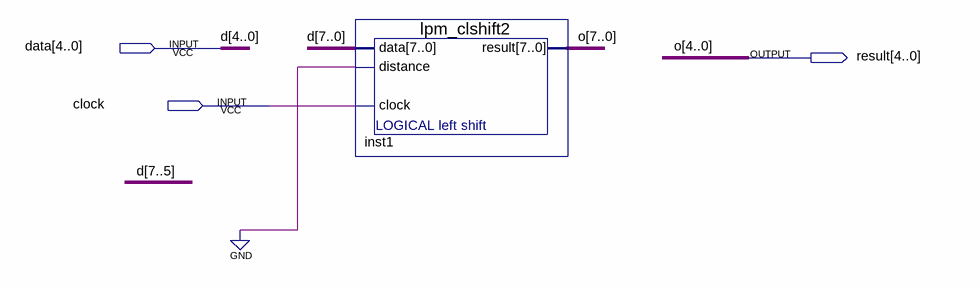
[diagram p0: schematic sheet]
// Quartus schematic 5bitreg.bdf as structural Verilog: 1 symbols, 3 pins
module \5bitreg  (
  input  [4:0] data,
  input  clock,
  output [4:0] result
);

  wire [7:5] d, o;

  lpm_clshift2 inst1 (.data({d, data}), .distance(1'b0), .clock(clock), .result({o, result}));

  // Other names for the same wires on the sheet: d[4:0] = data; o[4:0] = result
endmodule
